# Altium project Complex_PCB.PrjPcb (part 1 of 3)
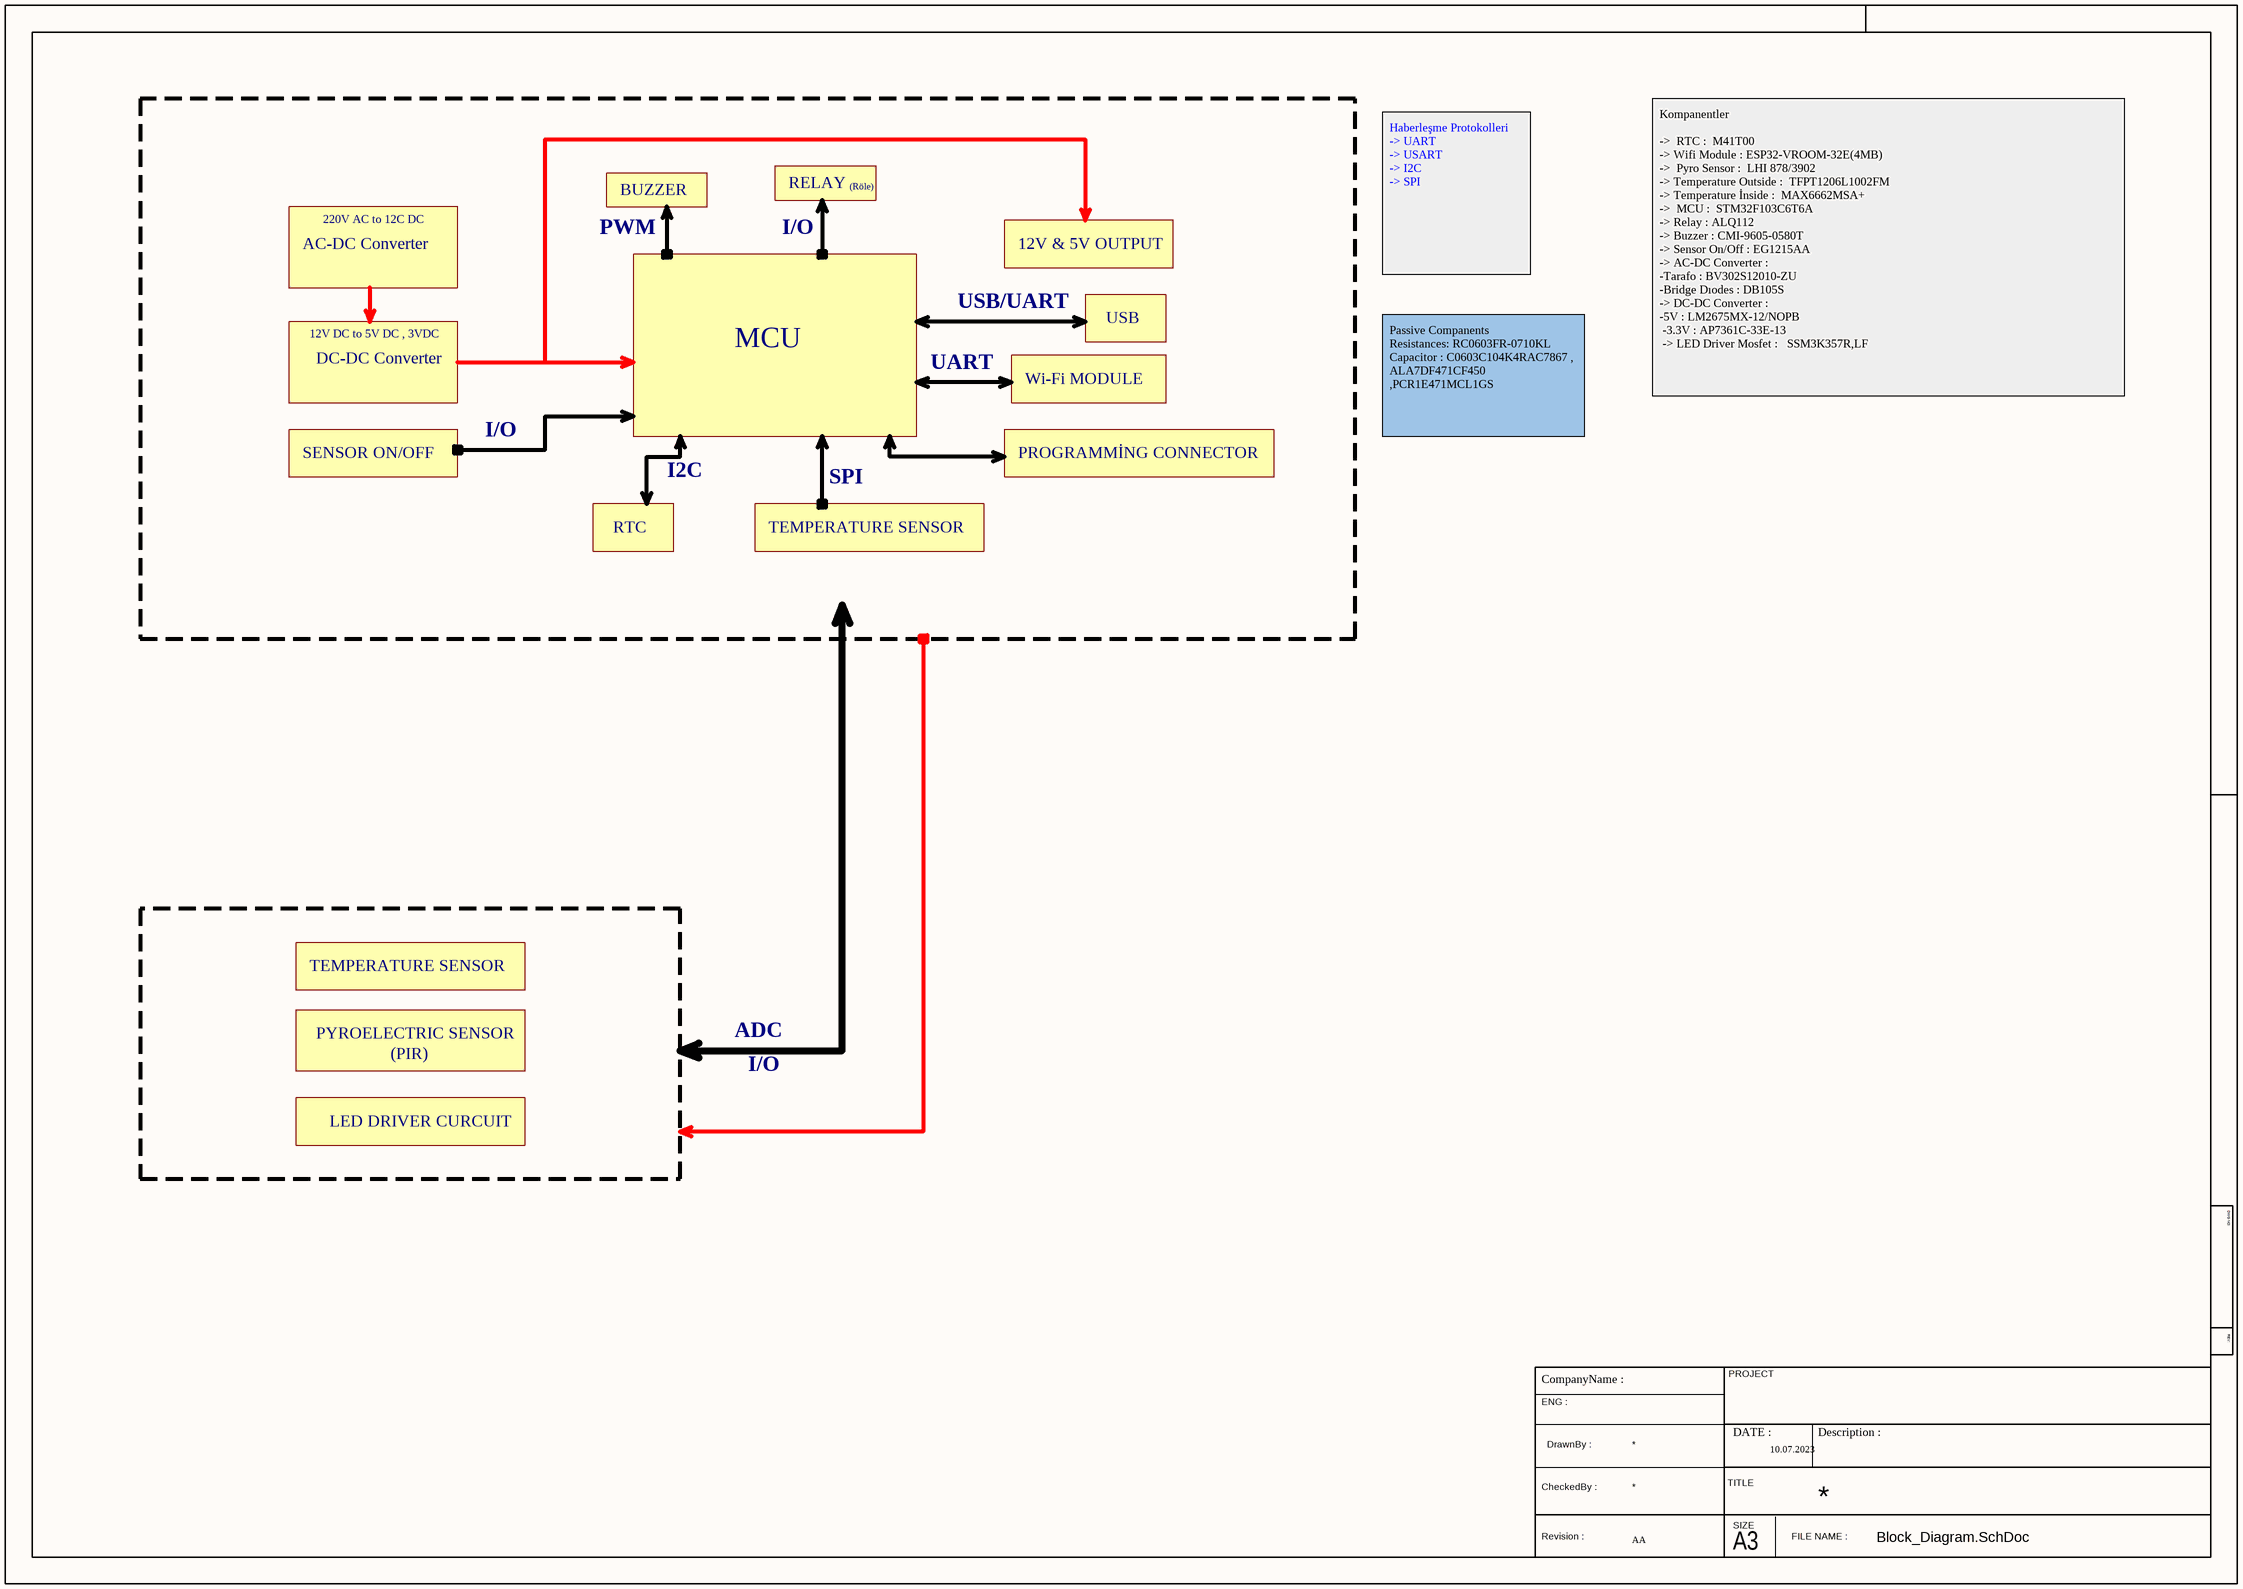
[diagram p0: Block_Diagram.SchDoc]
4 sheets, 127 parts. Net scope: flat (ports and power ports of the same name join across sheets).
Board file: ComplexCurcuit.PcbDoc
Sheets:
  Block_Diagram.SchDoc
  PowerManagment.SchDoc
  Microcontroller.SchDoc
  SensorBoard.SchDoc

## Sheet Block_Diagram.SchDoc
size 420 x 297 mm; Date: 10.07.2023; Revision: AA; SheetNumber: 1; SheetTotal: 4

### Notes on the sheet
- RELAY
- (Röle)
- AC-DC Converter
- 220V AC to 12C DC
- PWM
- BUZZER
- I/O
- 12V & 5V OUTPUT
- USB/UART
- USB
- Haberleşme Protokolleri                                                       -> UART                                                                               -> USART                                                                              -> I2C                                                                                   -> SPI
- 12V DC to 5V DC , 3VDC
- DC-DC Converter
- MCU
- UART
- Wi-Fi MODULE
- Kompanentler
  ->  RTC :  M41T00
  -> Wifi Module : ESP32-VROOM-32E(4MB)
  ->  Pyro Sensor :  LHI 878/3902
  -> Temperature Outside :  TFPT1206L1002FM
  -> Temperature İnside :  MAX6662MSA+
  ->  MCU :  STM32F103C6T6A
  -> Relay : ALQ112
  -> Buzzer : CMI-9605-0580T
  -> Sensor On/Off : EG1215AA
  -> AC-DC Converter :
  -Tarafo : BV302S12010-ZU
  -Bridge Dıodes : DB105S
  -> DC-DC Converter :
  -5V : LM2675MX-12/NOPB
  -3.3V : AP7361C-33E-13
  -> LED Driver Mosfet :   SSM3K357R,LF
- SENSOR ON/OFF
- PROGRAMMİNG CONNECTOR
- Passive Companents
  Resistances: RC0603FR-0710KL
  Capacitor : C0603C104K4RAC7867 ,
  ALA7DF471CF450 ,PCR1E471MCL1GS
- RTC
- I2C
- TEMPERATURE SENSOR
- SPI
- PYROELECTRIC SENSOR
- (PIR)
- ADC
- LED DRIVER CURCUIT
- DWG NO:
- REV:
- ENG :
- CompanyName :
- PROJECT
- DrawnBy :
- DATE :
- Description :
- Revision :
- CheckedBy :
- TITLE
- SIZE
- FILE NAME :
- A3

## Sheet PowerManagment.SchDoc
size 420 x 297 mm; SheetNumber: 2; SheetTotal: 5
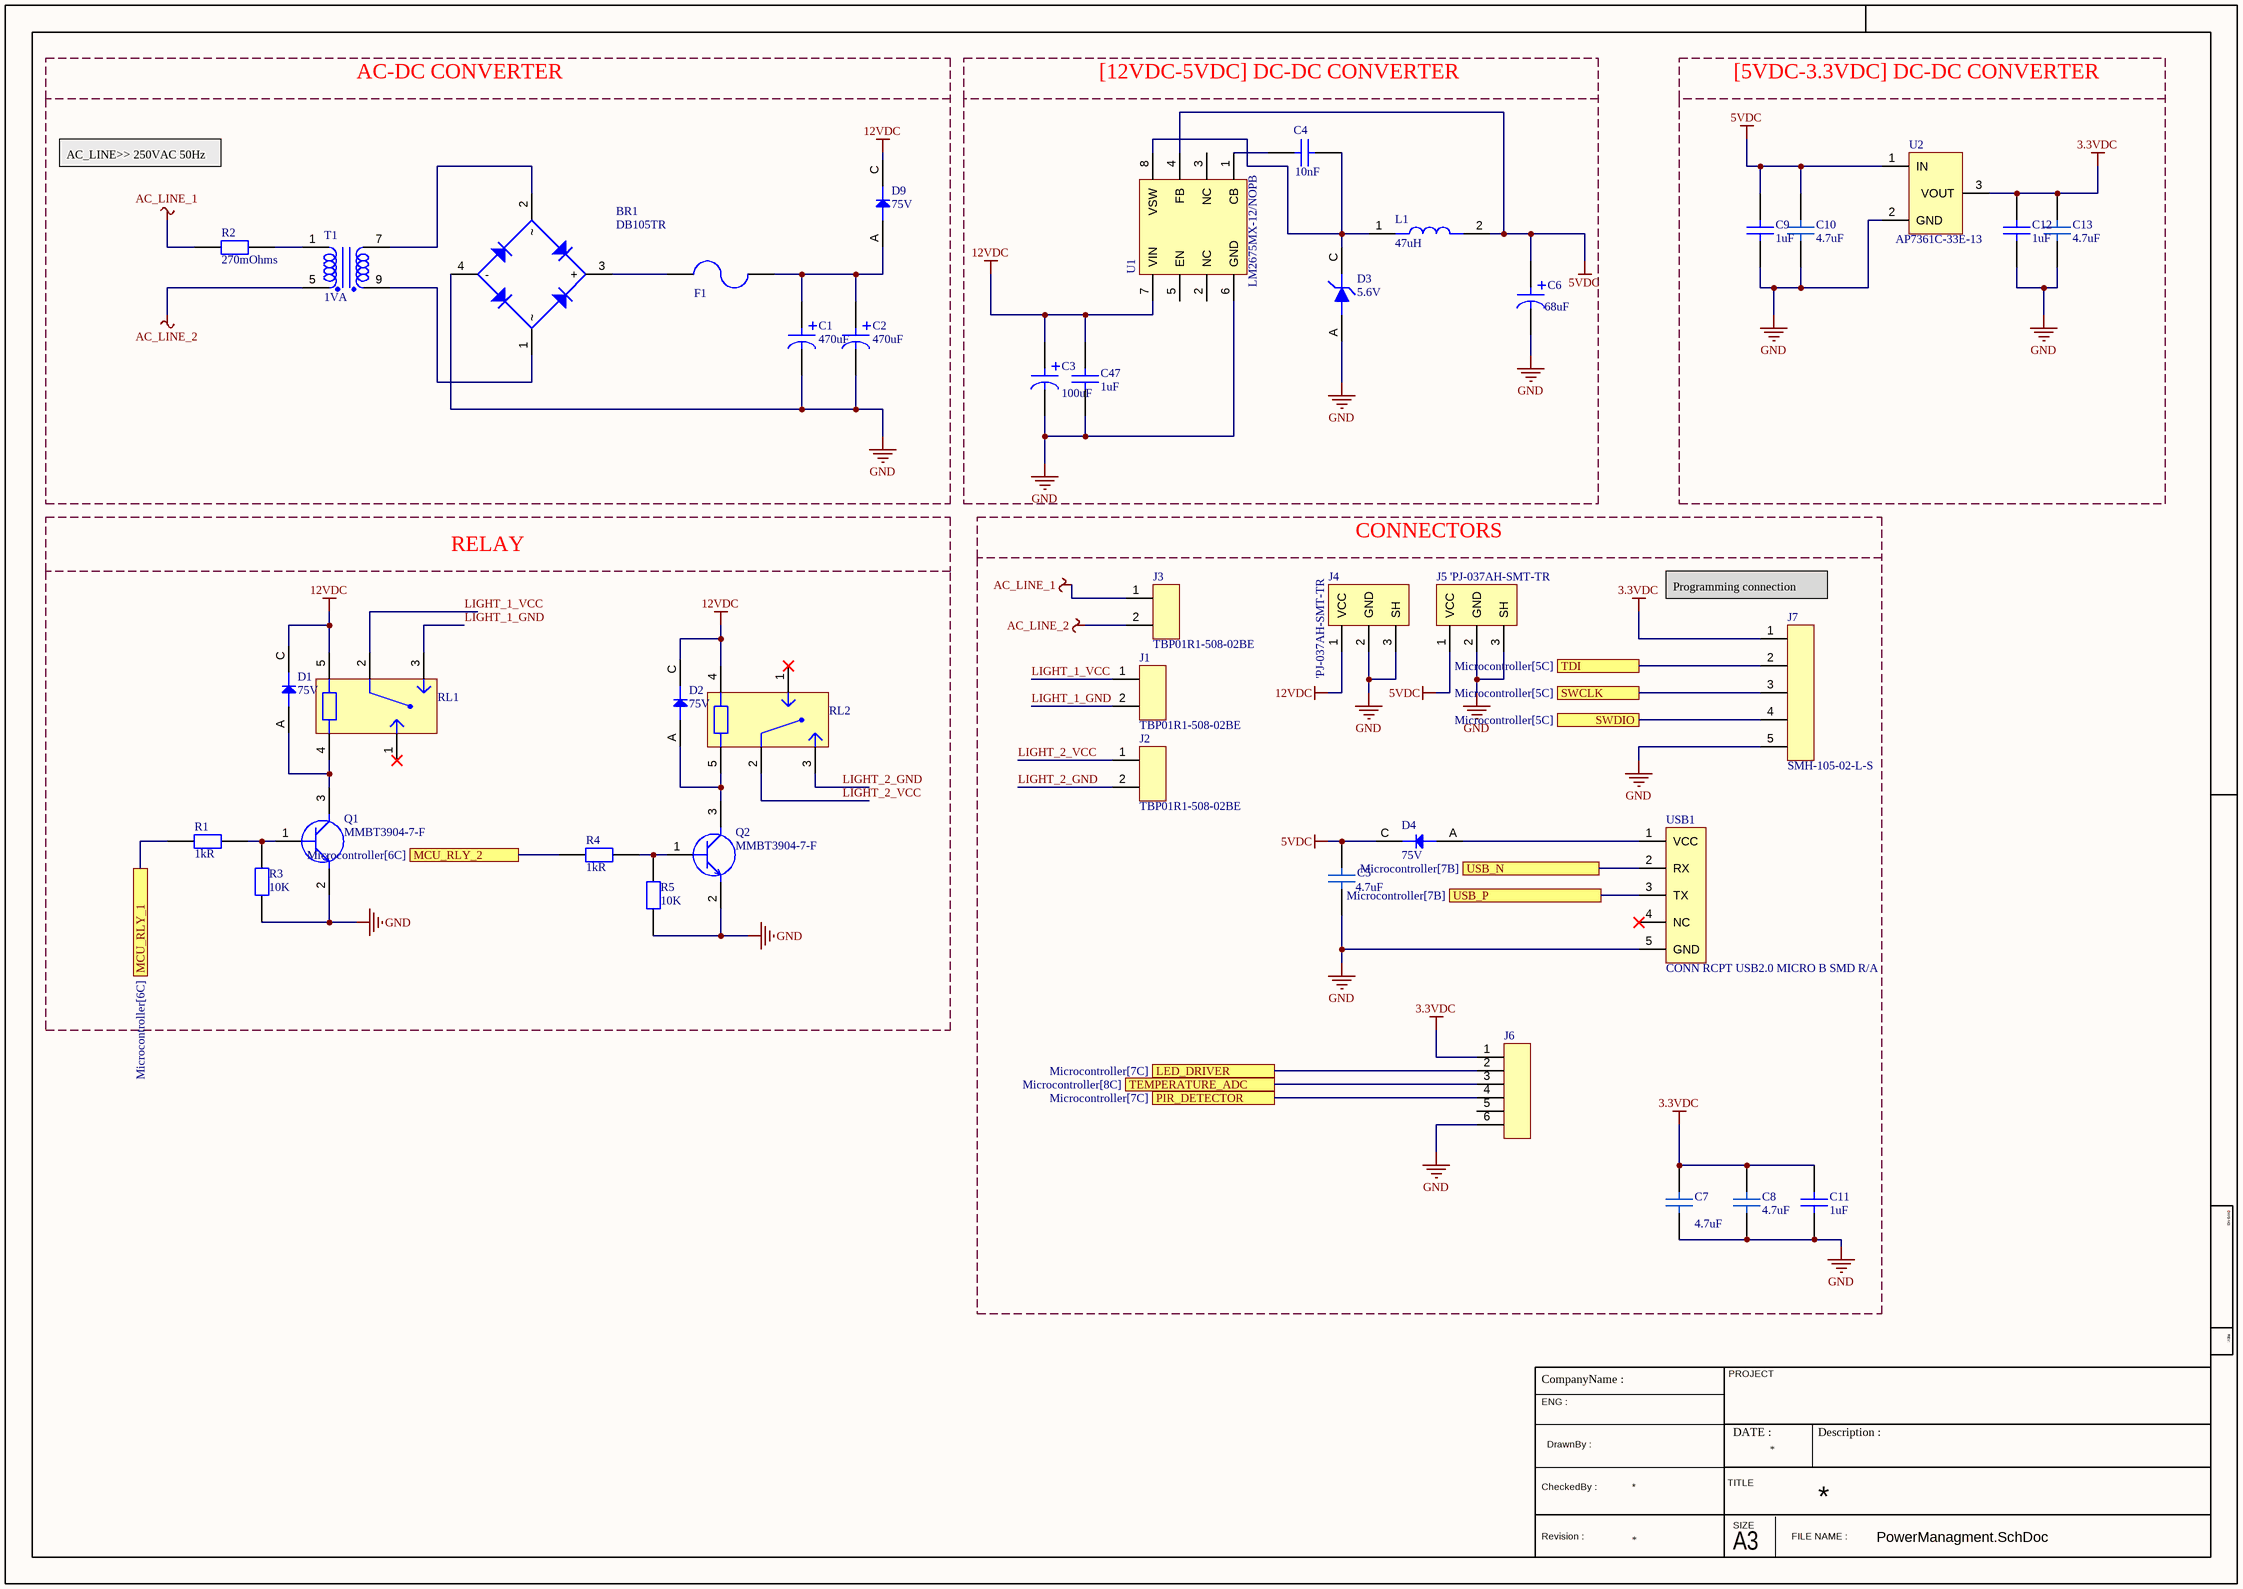
[diagram p1: PowerManagment.SchDoc]

### Parts
BR1  DB105TR  [DB105S]
C1  Capacitance: 470uF  [CAP _RADİAL_D10_P5]  (hidden comment: ESH477M050AH4AA CAP)
C2  Capacitance: 470uF  [CAP _RADİAL_D10_P5]  (hidden comment: ESH477M050AH4AA CAP)
C3  Capacity: 100uF  [CAP AEC Nichicon]  (hidden comment: UWT1H101MNL1GS)
C4  Capacity: 10nF  [CAP 0603]  (hidden comment: 0603B103K160CT)
C5  value 4.7uF  [CAP 0805]  (hidden comment: CAP CER 4.7UF 25V X5R 0805)
C6  Capacitance: 68uF  [CAP_EEVSERİES]  (hidden comment: EEV686M035A9HAA)
C7  value 4.7uF  [CAP 0805]  (hidden comment: CAP CER 4.7UF 25V X5R 0805)
C8  value 4.7uF  [CAP 0805]  (hidden comment: CAP CER 4.7UF 25V X5R 0805)
C9  Capacitance: 1uF  [CAP 0805]  (hidden comment: CAP CER 1UF 50V X7R 0805)
C10  value 4.7uF  [CAP 0805]  (hidden comment: CAP CER 4.7UF 25V X5R 0805)
C11  Capacitance: 1uF  [CAP 0805]  (hidden comment: CAP CER 1UF 50V X7R 0805)
C12  Capacitance: 1uF  [CAP 0805]  (hidden comment: CAP CER 1UF 50V X7R 0805)
C13  value 4.7uF  [CAP 0805]  (hidden comment: CAP CER 4.7UF 25V X5R 0805)
C47  Capacitance: 1uF  [CAP 0805]  (hidden comment: CAP CER 1UF 50V X7R 0805)
D1  Operating Voltage: 75V  [SOD323F]  (hidden comment: DIODE GEN PURP 75V 150MA SOD323F)
D2  Operating Voltage: 75V  [SOD323F]  (hidden comment: DIODE GEN PURP 75V 150MA SOD323F)
D3  Working Voltage: 5.6V  [SMB]  (hidden comment: 1SMB5919BT3G)
D4  Operating Voltage: 75V  [SOD323F]  (hidden comment: DIODE GEN PURP 75V 150MA SOD323F)
D9  Operating Voltage: 75V  [SOD323F]  (hidden comment: DIODE GEN PURP 75V 150MA SOD323F)
F1  3413.0216.22  [3413.0216.22 FUSE]  (value not drawn)
J1  TBP01R1-508-02BE  [TBP01R1-508]
J2  TBP01R1-508-02BE  [TBP01R1-508]
J3  TBP01R1-508-02BE  [TBP01R1-508]
J4  'PJ-037AH-SMT-TR  [JACK]
J5  'PJ-037AH-SMT-TR  [JACK]
J6  64800611622 Datasheet WR-WTB Male Vertical Shrouded Header  [64800611622 Connector-1x6 Male Header]  (value not drawn)
J7  SMH-105-02-L-S  [SMH-105-02-L-S]
L1  value 47uH  [IND_1212]  (hidden comment: 78438335470)
Q1  MMBT3904-7-F  [SOT23F]
Q2  MMBT3904-7-F  [SOT23F]
R1  value 1kR  [RES 0603]  (hidden comment: RC0603FR-071KL)
R2  Resistance: 270mOhms  [RES_AXİAL_W]  (hidden comment: 5WD27)
R3  Resistance: 10K  [RES 0603]  (hidden comment: RES 10K OHM  06103)
R4  value 1kR  [RES 0603]  (hidden comment: RC0603FR-071KL)
R5  Resistance: 10K  [RES 0603]  (hidden comment: RES 10K OHM  06103)
RL1  ALQ112  [ALQ112]  (value not drawn)
RL2  ALQ112  [ALQ112]  (value not drawn)
T1  Rated Power: 1VA  [BV302S]  (hidden comment: BV302S12010)
U1  LM2675MX-12/NOPB  [SOIC8]
U2  AP7361C-33E-13  [SOT223]
USB1  CONN RCPT USB2.0 MICRO B SMD R/A  [Micro B USB Connector]

### Blocks framed on the sheet
AC-DC CONVERTER: BR1 C1 C2 D9 F1 R2 T1
[12VDC-5VDC] DC-DC CONVERTER: C3 C4 C6 C47 D3 L1 U1
[5VDC-3.3VDC] DC-DC CONVERTER: C9 C10 C12 C13 U2
RELAY: D1 D2 Q1 Q2 R1 R3-R5 RL1 RL2
CONNECTORS: C5 C7 C8 C11 D4 J1-J7 USB1

### Ports
LED_DRIVER (see Microcontroller[7C]), MCU_RLY_1 (see Microcontroller[6C]), MCU_RLY_2 (see Microcontroller[6C]), PIR_DETECTOR (see Microcontroller[7C]), SWCLK (see Microcontroller[5C]), SWDIO (see Microcontroller[5C]), TDI (see Microcontroller[5C]), TEMPERATURE_ADC (see Microcontroller[8C]), USB_N (see Microcontroller[7B]), USB_P (see Microcontroller[7B])

### Nets
3.3VDC: C7.2 C8.2 C11.2 C12.1 C13.1 J6.1 J7.1 U2.3(VOUT)
5VDC: C5.2 C6.1 C9.1 C10.1 D4.C(Cathode) J5.1(VCC) L1.2 U1.4(FB) U2.1(IN)
12VDC: C3.1 C47.1 D1.C(Cathode) D2.C(Cathode) D9.C(Cathode) J4.1(VCC) RL1.5 RL2.4 U1.7(VIN)
AC_LINE_1: J3.1 R2.1
AC_LINE_2: J3.2 T1.5
GND: BR1.4(-) C1.2 C2.2 C3.2 C5.1 C6.2 C7.1 C8.1 C9.2 C10.2 C11.1 C12.2 C13.2 C47.2 D3.A(Anode) J4.2(GND) J4.3(SH) J5.2(GND) J5.3(SH) J6.6 J7.5 Q1.2(EMİTTER) Q2.2(EMİTTER) R3.1 R5.1 U1.6(GND) U2.2(GND) USB1.5(GND)
LIGHT_1_GND: J1.2 RL1.3
LIGHT_1_VCC: J1.1 RL1.2
LIGHT_2_GND: J2.2 RL2.3
LIGHT_2_VCC: J2.1 RL2.2
USB_N: USB1.2(RX) ; port USB_N
USB_P: USB1.3(TX) ; port USB_P
NetBR1_1: BR1.1 T1.9
NetBR1_2: BR1.2 T1.7
NetBR1_3: BR1.3(+) F1.1
NetC1_1: C1.1 C2.1 D9.A(Anode) F1.2
NetC4_1: C4.1 U1.1(CB)
NetC4_2: C4.2 D3.C(Cathode) L1.1 U1.8(VSW)
NetD1_A: D1.A(Anode) Q1.3(CONNECTOR) RL1.4
NetD2_A: D2.A(Anode) Q2.3(CONNECTOR) RL2.5
NetD4_A: D4.A(Anode) USB1.1(VCC)
NetJ6_2: J6.2 ; port LED_DRIVER
NetJ6_3: J6.3 ; port TEMPERATURE_ADC
NetJ6_4: J6.4 ; port PIR_DETECTOR
NetJ7_2: J7.2 ; port TDI
NetJ7_3: J7.3 ; port SWCLK
NetJ7_4: J7.4 ; port SWDIO
NetQ1_1: Q1.1(BASE) R1.2 R3.2
NetQ2_1: Q2.1(BASE) R4.2 R5.2
NetR1_1: R1.1 ; port MCU_RLY_1
NetR2_2: R2.2 T1.1
NetR4_1: R4.1 ; port MCU_RLY_2

Not connected (* = marked no-connect by the designer): J6 5; RL1 1*; RL2 1*; U1 2(NC) 3(NC) 5(EN); USB1 4(NC)*

### Notes on the sheet
- AC_LINE>> 250VAC 50Hz
- (near J7) Programming connection
- DWG NO:
- REV:
- ENG :
- CompanyName :
- PROJECT
- DrawnBy :
- DATE :
- Description :
- Revision :
- CheckedBy :
- TITLE
- SIZE
- FILE NAME :
- A3

### Library data of the parts
BR1 = DB105TR: Bridge Rectifier, Full Wave, 600 Volt,; Manufacturer: SMC Diode Solutions; Designed By: Görkem Bulut; Max Curent: 1A; Operating Voltage: 600V; Supplier: Digi-Key; Supplier Part Number: 1655-DB105STR-ND; Manufacturer Part Number: DB105S; RoHS: Yes; Category: Rectifier Diodes; Stock: 1865; Min Operating Temperature: -55°C; Max Operating Temperature: 150°C; RoHS Compliant: Yes; ComponentLink1URL: http://www.mouser.com/ds/2/345/db101-107-32844.pdf?src-supplier=Mouser; ComponentLink1Description: http://www.mouser.com/ds/2/345/db101-107-32844.pdf?src-supplier=Mouser; Case Package: DB-S; Number of Pins: 4
C1 C2 = ESH477M050AH4AA CAP: Cap, 470UF, 50V, Alu Elec, Radial; Manufacturer: KEMET; Designed By: Görkem Bulut; Supplier: Digi-Key; Supplier Part Number: 399-15683-ND; Manufacturer Part Number: ESH477M050AH4AA; RoHS: Yes; Stock: 6719; Pricing: 1=0,68, 10=0,482, 50=0,3646, 100=0,3175, 500=0,23518, 1000=0,19991, 2500=0,18815, 5000=0,17639 (USD); ComponentLink1URL: https://api.kemet.com/component-edge/download/datasheet/ESH477M050AH4AA.pdf?src-supplier=Digi-Key; ComponentLink1Description: https://api.kemet.com/component-edge/download/datasheet/ESH477M050AH4AA.pdf?src-supplier=Digi-Key; ComponentLink2URL: https://datasheet.octopart.com/ESH477M050AH4AA-KEMET-datasheet-130075338.pdf?src-supplier=Newark; ComponentLink2Description: https://datasheet.octopart.com/ESH477M050AH4AA-KEMET-datasheet-130075338.pdf?src-supplier=Newark
C3 = CAP CER 100uF AEC: Aluminum Electrolytic Capacitor, 100uF 50 V dc, WT Series 1000h 8 (Dia.) x 10mm; Manufacturer: Nichicon; Designed By: Görkem BULUT; Supplier: Digi-Key; Supplier Part Number: 493-2226-1-ND; Manufacturer Part Number: UWT1H101MNL1GS; RoHS: Yes; Category: Aluminum Electrolytic Capacitors; Stock: 94104; Pricing: 1=0,45, 10=0,317, 50=0,2398, 100=0,2089 (USD); ComponentLink1URL: https://datasheet.ciiva.com/97/e-wt-97104.pdf?src-supplier=Digi-Key; ComponentLink1Description: https://datasheet.ciiva.com/97/e-wt-97104.pdf?src-supplier=Digi-Key; ComponentLink2URL: https://datasheet.ciiva.com/97/e-wt-97105.pdf?src-supplier=Digi-Key; ComponentLink2Description: https://datasheet.ciiva.com/97/e-wt-97105.pdf?src-supplier=Digi-Key; ComponentLink3URL: https://datasheet.ciiva.com/97/e-wt-97106.pdf?src-supplier=Digi-Key; ComponentLink3Description: https://datasheet.ciiva.com/97/e-wt-97106.pdf?src-supplier=Digi-Key; ComponentLink4URL: https://datasheet.ciiva.com/11776/0900766b80fa3a91-11776930.pdf?src-supplier=Rs; ComponentLink4Description: https://datasheet.ciiva.com/11776/0900766b80fa3a91-11776930.pdf?src-supplier=Rs; ComponentLink5URL: https://datasheet.ciiva.com/16502/e-wt-16502940.pdf?src-supplier=Future+Electronics; ComponentLink5Description: https://datasheet.ciiva.com/16502/e-wt-16502940.pdf?src-supplier=Future+Electronics; ComponentLink6URL: https://datasheet.ciiva.com/5362/e-wt-30307-5362773.pdf?src-supplier=Mouser; ComponentLink6Description: https://datasheet.ciiva.com/5362/e-wt-30307-5362773.pdf?src-supplier=Mouser; ComponentLink7URL: https://datasheet.ciiva.com/11686/e-wt-11686889.pdf?src-supplier=Avnet; ComponentLink7Description: https://datasheet.ciiva.com/11686/e-wt-11686889.pdf?src-supplier=Avnet; ComponentLink8URL: https://datasheet.ciiva.com/28458/1910938-28458459.pdf?src-supplier=Element14; ComponentLink8Description: https://datasheet.ciiva.com/28458/1910938-28458459.pdf?src-supplier=Element14; ComponentLink9URL: https://datasheet.ciiva.com/7781/e-wt-7781807.pdf?src-supplier=Element14; ComponentLink9Description: https://datasheet.ciiva.com/7781/e-wt-7781807.pdf?src-supplier=Element14; Package/Case: Radial, Can - SMD
C4 = CAP CER 10nF: Multilayer Ceramic Capacitor, 0.01 F, 10%, X7R, 16 V, 0603 [1608 Metric] RoHS Compliant: Yes; Manufacturer: Walsin Technologies; Supplier: Digi-Key; Supplier Part Number: 1292-1384-1-ND; Manufacturer Part Number: 0603B103K160CT; RoHS: Yes; Category: Ceramic Capacitors; Stock: 44618; Pricing: 1=0,1, 10=0,033, 50=0,0182, 100=0,0148, 500=0,0106, 1000=0,00833 (USD); ComponentLink1URL: http://www.farnell.com/datasheets/1958513.pdf?src-supplier=Farnell; ComponentLink1Description: http://www.farnell.com/datasheets/1958513.pdf?src-supplier=Farnell; ComponentLink2URL: http://www.passivecomponent.com/wp-content/uploads/2018/10/MLCC.pdf?src-supplier=Digi-Key; ComponentLink2Description: http://www.passivecomponent.com/wp-content/uploads/2018/10/MLCC.pdf?src-supplier=Digi-Key; ComponentLink3URL: https://datasheet.octopart.com/0603B103K160CT-Walsin-Technologies-datasheet-85392065.pdf?src-supplier=Element14; ComponentLink3Description: https://datasheet.octopart.com/0603B103K160CT-Walsin-Technologies-datasheet-85392065.pdf?src-supplier=Element14; ComponentLink4URL: https://datasheet.octopart.com/0603B103K160CT-Walsin-Technologies-datasheet-136037192.pdf?src-supplier=Future+Electronics; ComponentLink4Description: https://datasheet.octopart.com/0603B103K160CT-Walsin-Technologies-datasheet-136037192.pdf?src-supplier=Future+Electronics; ComponentLink5URL: https://datasheet.octopart.com/0603B103K160CT-Walsin-Technologies-datasheet-62066062.pdf?src-supplier=TME; ComponentLink5Description: https://datasheet.octopart.com/0603B103K160CT-Walsin-Technologies-datasheet-62066062.pdf?src-supplier=TME; Case/Package: 0603
C5 C7 C8 C10 C13 = CAP CER 4.7uF: Manufacturer: Samsung; Manufacturer Part Number: CL21A475KAQNNNE; Tolerance: 10%; Supplier: Digi-Key; Supplier Part Number: 1276-1244-1-ND; RoHS: Yes; Category: Ceramic Capacitors; Stock: 3937628; Pricing: 1=0,1, 10=0,073, 50=0,0414, 100=0,0344, 500=0,02408, 1000=0,01994 (USD); Mounting Technology: Surface Mount; Case/Package: 0805; Case Code (Metric): 2012; Case Code (Imperial): 0805; Min Operating Temperature: -55°C; Max Operating Temperature: 85°C; Packaging: Tape and Reel; Voltage Rating: 25V; Dielectric: X5R; Voltage Rating (DC): 25V; Series: CL; Construction: Flat; Length: 2mm; Height: 1.25mm; Depth: 1.25mm; Radiation Hardening: No; Lead Free: Lead Free; RoHS Compliant: Yes; ComponentLink1URL: https://datasheet.ciiva.com/25798/cl21a475kaqnnne-25798882.pdf?src-supplier=Digi-Key; ComponentLink1Description: https://datasheet.ciiva.com/25798/cl21a475kaqnnne-25798882.pdf?src-supplier=Digi-Key
C6 = CAP 68uF AEC: Cap Aluminum Lytic 68uF 35V 20%( 6.3 X 7.7mm) SMD 0.34 Ohm 280mA 2000h 105C T/R; Manufacturer: KEMET; Designed By: Görkem Bulut; Supplier: Digi-Key; Supplier Part Number: 399-6722-1-ND; Manufacturer Part Number: EEV686M035A9HAA; RoHS: Yes; Category: Aluminum Electrolytic Capacitors; Stock: 22871; Pricing: 1=0,62, 10=0,439, 50=0,332, 100=0,2892, 500=0,21422 (USD); ComponentLink1URL: https://datasheet.ciiva.com/5365/kem-a4002-eev-535332-5365784.pdf?src-supplier=Mouser; ComponentLink1Description: https://datasheet.ciiva.com/5365/kem-a4002-eev-535332-5365784.pdf?src-supplier=Mouser; Case Package: Radial,Can-SMD
C9 C11 C12 C47 = CAP CER 1uF: Manufacturer: Samsung; Manufacturer Part Number: CL21B105KBFNNNE; Designed By: Görkem Bulut; Supplier: Digi-Key; Supplier Part Number: 1276-1029-1-ND; RoHS: Yes; Category: Ceramic Capacitors; Stock: 142606; Pricing: 1=0,11, 10=0,079, 50=0,045, 100=0,0373, 500=0,02616, 1000=0,02165 (USD); ComponentLink1URL: https://datasheet.ciiva.com/16449/cl21b105kbfnnne-16449003.pdf?src-supplier=Future+Electronics; ComponentLink1Description: https://datasheet.ciiva.com/16449/cl21b105kbfnnne-16449003.pdf?src-supplier=Future+Electronics; ComponentLink2URL: https://datasheet.ciiva.com/25800/cl21b105kbfnnne-25800291.pdf?src-supplier=Digi-Key; ComponentLink2Description: https://datasheet.ciiva.com/25800/cl21b105kbfnnne-25800291.pdf?src-supplier=Digi-Key; Case Package: 0805
D1 D2 D4 D9 = 1N4148WS: VR=75V IF=150mA Trr=4ns P=200mW; Manufacturer: ON Semiconductor / Fairchild; Designed By: Görkem Bulut; Supplier: Digi-Key; Supplier Part Number: 1N4148WSFSCT-ND; Manufacturer Part Number: 1N4148WS; RoHS: Yes; Category: Rectifier Diodes; Stock: 1572050; Pricing: 1=0,18, 10=0,169, 100=0,0918, 500=0,0565, 1000=0,03852 (USD); ComponentLink1URL: https://datasheet.ciiva.com/15208/getdatasheetpartid-127819-15208358.pdf?src-supplier=Verical; ComponentLink1Description: https://datasheet.ciiva.com/15208/getdatasheetpartid-127819-15208358.pdf?src-supplier=Verical; Case Package: SOD323F; Operatşng Current: 150mA
D3 = 1SMB5919BT3G: Vz=5.6V 5.32V~5.88V Izt=66.9mA; Manufacturer: ON Semiconductor; Designed By: Görkem Bulut; Supplier: Mouser; Supplier Part Number: 863-1SMB5919BT3G; Manufacturer Part Number: 1SMB5919BT3G; RoHS: Yes; Category: Zener Diodes; Stock: 197; Pricing: 1=0,51, 10=0,37, 50=0,37, 100=0,231, 1000=0,128, 10000=0,094 (USD); ComponentLink1URL: https://datasheet.ciiva.com/27747/1308331-27747654.pdf?src-supplier=Jameco; ComponentLink1Description: https://datasheet.ciiva.com/27747/1308331-27747654.pdf?src-supplier=Jameco; ComponentLink2URL: https://datasheet.ciiva.com/895/1smb5913bt3-d-895203.pdf?src-supplier=Digi-Key; ComponentLink2Description: https://datasheet.ciiva.com/895/1smb5913bt3-d-895203.pdf?src-supplier=Digi-Key; ComponentLink3URL: https://datasheet.ciiva.com/895/1smb5913bt3-d-895204.pdf?src-supplier=Digi-Key; ComponentLink3Description: https://datasheet.ciiva.com/895/1smb5913bt3-d-895204.pdf?src-supplier=Digi-Key; ComponentLink4URL: https://datasheet.ciiva.com/895/1smb5913bt3-d-895205.pdf?src-supplier=Digi-Key; ComponentLink4Description: https://datasheet.ciiva.com/895/1smb5913bt3-d-895205.pdf?src-supplier=Digi-Key; ComponentLink5URL: https://datasheet.ciiva.com/15198/getdatasheetpartid-311040-15198695.pdf?src-supplier=Verical; ComponentLink5Description: https://datasheet.ciiva.com/15198/getdatasheetpartid-311040-15198695.pdf?src-supplier=Verical; ComponentLink6URL: https://datasheet.ciiva.com/1182/1smb5913bt3-d-1182657.pdf?src-supplier=Element14; ComponentLink6Description: https://datasheet.ciiva.com/1182/1smb5913bt3-d-1182657.pdf?src-supplier=Element14; ComponentLink7URL: https://datasheet.ciiva.com/1182/1smb5913bt3-d-1182658.pdf?src-supplier=Element14; ComponentLink7Description: https://datasheet.ciiva.com/1182/1smb5913bt3-d-1182658.pdf?src-supplier=Element14; ComponentLink8URL: https://datasheet.ciiva.com/16311/1smb5913bt3-d-16311847.pdf?src-supplier=Future+Electronics; ComponentLink8Description: https://datasheet.ciiva.com/16311/1smb5913bt3-d-16311847.pdf?src-supplier=Future+Electronics; Case Package: SMB
F1 = FUSE 3413.0216.22: Fuse Chip Fast Acting 1A 32V SMD Solder Pad 1206 Glass T/R VDE/cULus; Manufacturer: Schurter; Designed By: Görkem Bulut; Supplier: Digi-Key; Supplier Part Number: 486-1144-1-ND; Manufacturer Part Number: 3413.0216.22; RoHS: Yes; Category: Fuses; Stock: 9197; Pricing: 1=0,67, 50=0,524, 100=0,397, 500=0,3132 (USD); ComponentLink1URL: https://datasheet.ciiva.com/301/typ-usi-1206-301440.pdf?src-supplier=Digi-Key; ComponentLink1Description: https://datasheet.ciiva.com/301/typ-usi-1206-301440.pdf?src-supplier=Digi-Key; ComponentLink2URL: https://datasheet.ciiva.com/14102/qousi1206-data-e-14102903.pdf?src-supplier=Distrelec; ComponentLink2Description: https://datasheet.ciiva.com/14102/qousi1206-data-e-14102903.pdf?src-supplier=Distrelec; ComponentLink3URL: https://datasheet.ciiva.com/16316/typ-usi-1206-16316588.pdf?src-supplier=Future+Electronics; ComponentLink3Description: https://datasheet.ciiva.com/16316/typ-usi-1206-16316588.pdf?src-supplier=Future+Electronics; ComponentLink4URL: https://datasheet.ciiva.com/301/typ-usi-1206-301439.pdf?src-supplier=Digi-Key; ComponentLink4Description: https://datasheet.ciiva.com/301/typ-usi-1206-301439.pdf?src-supplier=Digi-Key; ComponentLink5URL: https://datasheet.ciiva.com/301/typ-usi-1206-301441.pdf?src-supplier=Digi-Key; ComponentLink5Description: https://datasheet.ciiva.com/301/typ-usi-1206-301441.pdf?src-supplier=Digi-Key; ComponentLink6URL: https://datasheet.ciiva.com/8264/typ-usi-1206-8264583.pdf?src-supplier=Avnet; ComponentLink6Description: https://datasheet.ciiva.com/8264/typ-usi-1206-8264583.pdf?src-supplier=Avnet; ComponentLink7URL: https://datasheet.ciiva.com/14541/70160006-14541114.pdf?src-supplier=Allied+Electronics; ComponentLink7Description: https://datasheet.ciiva.com/14541/70160006-14541114.pdf?src-supplier=Allied+Electronics
J1-J3 = TBP01R1-508-02BE: 2~24 Poles, Pluggable, Receptacle, Horizontal, 5.08 Pitch, Terminal Block Connector; Manufacturer: CUI Devices; Designed by: GÖRKEM BULUT; Supplier: Digi-Key; Supplier Part Number: 102-6406-ND; Manufacturer Part Number: TBP01R1-508-02BE; RoHS: Yes; Category: Terminal Blocks; Stock: 123466; Pricing: 1=0,56, 10=0,296, 25=0,2096, 50=0,1784, 100=0,1722, 250=0,1456, 500=0,13464, 1000=0,11898, 5000=0,0908 (USD); ComponentLink1URL: https://www.cuidevices.com/product/resource/digikeypdf/tbp01r1-508.pdf?src-supplier=Digi-Key; ComponentLink1Description: https://www.cuidevices.com/product/resource/digikeypdf/tbp01r1-508.pdf?src-supplier=Digi-Key; ComponentLink2URL: https://datasheet.octopart.com/TBP01R1-508-02BE-CUI-Devices-datasheet-147843976.pdf?src-supplier=Future+Electronics; ComponentLink2Description: https://datasheet.octopart.com/TBP01R1-508-02BE-CUI-Devices-datasheet-147843976.pdf?src-supplier=Future+Electronics; ComponentLink3URL: https://datasheet.octopart.com/TBP01R1-508-02BE-CUI-Devices-datasheet-154730754.pdf?src-supplier=Electro+Sonic; ComponentLink3Description: https://datasheet.octopart.com/TBP01R1-508-02BE-CUI-Devices-datasheet-154730754.pdf?src-supplier=Electro+Sonic
J4 J5 = PJ-037AH-SMT-TR: 2.0 x 6.3 mm, 5.0 A, Horizontal, Surface Mount (SMT), Dc Power Jack Connector; Manufacturer: CUI; Number of Conductors: 2; Gender: Male; Shielding: Unshielded; Current Rating: 5A; Voltage Rating: 24V; Insulation Resistance: 100MR; Designed By: Görkem Bulut; Supplier: Digi-Key; Supplier Part Number: CP-037AHPJCT-ND; Manufacturer Part Number: PJ-037AH-SMT-TR; RoHS: Yes; Category: Uncategorized; Mounting Technology: Surface Mount,Through Hole; Case/Package: SMD/SMT; Color: Black; Contact Material: Copper; Contact Plating: Nickel; Housing Color: Black; Housing Material: Thermoplastic; Min Operating Temperature: -25°C; Max Operating Temperature: 85°C; Orientation: Horizontal; Package Quantity: 200; Termination: Solder; Connector Type: Jack; Contact Gender: Male; Packaging: Tape and Reel; Flammability Rating: UL94 V-0; ComponentLink1URL: http://www.mouser.com/ds/2/670/pj-037ah-smt-516065.pdf?src-supplier=Mouser; ComponentLink1Description: http://www.mouser.com/ds/2/670/pj-037ah-smt-516065.pdf?src-supplier=Mouser; ComponentLink2URL: https://www.cui.com/product/resource/digikeypdf/pj-037ah-smt-tr.pdf?src-supplier=Digi-Key; ComponentLink2Description: https://www.cui.com/product/resource/digikeypdf/pj-037ah-smt-tr.pdf?src-supplier=Digi-Key; ComponentLink3URL: http://www.cui.com/product/resource/digikeypdf/pj-037ah-smt.pdf?src-supplier=Digi-Key; ComponentLink3Description: http://www.cui.com/product/resource/digikeypdf/pj-037ah-smt.pdf?src-supplier=Digi-Key
J6 = 1x6 Male Header-64800611622 Connector: WR-WTB Wire-to-Board Connectors 1.50 mm; Manufacturer: Wurth Electronics; Designed By: Görkem Bulut; Supplier: Digi-Key; Supplier Part Number: 732-64800611622-ND; Manufacturer Part Number: 64800611622; RoHS: No; Category: Uncategorized; Stock: 924; Pricing: 1=0,42, 50=0,406, 100=0,384, 250=0,361, 500=0,339 (USD)
J7 = SMH-105-02-L-S: .100 C.L. HORIZONTAL SMT SOCKET; Manufacturer: Samtec; Number of Contacts: 5; Gender: Receptacle; Pitch: 2.54mm; Supplier: Digi-Key; Supplier Part Number: SAM11813-ND; Manufacturer Part Number: SMH-105-02-L-S; RoHS: Yes; Category: Connectors; Stock: 101; Pricing: 1=2,18, 10=1,899, 100=1,6968, 500=1,414, 1000=1,212, 5000=1,07464 (USD); Contact Plating: Gold; Contact Material: Bronze; Contact Finish - Mating: GOLD; Insulation Color: Black; Insulation Material: Polymer; Contact Shape: Square; Min Operating Temperature: -55°C; Max Operating Temperature: 125°C; Packaging: Rail/Tube; Number of Rows: 1; Termination: Solder; Orientation: Horizontal; Connector Type: Receptacle; Fastening Type: Pull; Series: SMH; Contact Type: Forked; Number of Positions: 5; Radiation Hardening: No; RoHS Compliant: Yes; Reach SVHC Compliant: No; Flammability Rating: UL94 V-0; ComponentLink1URL: http://www.farnell.com/datasheets/1927708.pdf?_ga=2.237598468.569325269.1503285096-1413671594.1503025027&src-supplier=Farnell; ComponentLink1Description: http://www.farnell.com/datasheets/1927708.pdf?_ga=2.237598468.569325269.1503285096-1413671594.1503025027&src-supplier=Farnell; ComponentLink2URL: http://www.samtec.com/documents/webfiles/pdf/SMH.PDF?src-supplier=Newark; ComponentLink2Description: http://www.samtec.com/documents/webfiles/pdf/SMH.PDF?src-supplier=Newark; ComponentLink3URL: http://www.samtec.com/documents/webfiles/pdf/SMH.PDF?src-supplier=Avnet; ComponentLink3Description: http://www.samtec.com/documents/webfiles/pdf/SMH.PDF?src-supplier=Avnet; ComponentLink4URL: http://suddendocs.samtec.com/catalog_english/smh.pdf?src-supplier=Digi-Key; ComponentLink4Description: http://suddendocs.samtec.com/catalog_english/smh.pdf?src-supplier=Digi-Key
L1 = IND 47uH: Power Inductor, Aec-Q200, 47Uh, 0.39A Rohs Compliant: Yes |Wurth Elektronik 78438335470; Manufacturer: Wurth Electronics; Core Material: Ferrite; Current Rating: 390mA; Saturation Current: 1.18A; Shielding: Shielded; DC Resistance (DCR): 2.3R; Self Resonant Frequency: 8MHz; Test Frequency: 100kHz; Tolerance: 30%; Designed By: Görkem Bulut; Supplier: Digi-Key; Supplier Part Number: 732-6947-1-ND; Manufacturer Part Number: 78438335470; RoHS: Yes; Category: Fixed Inductors; Stock: 14920; Pricing: 1=2,11, 50=1,97, 250=1,803, 500=1,672 (USD); Mounting Technology: Surface Mount; Case/Package: 1212; Case Code (Metric): 3030; Case Code (Imperial): 1212; Min Operating Temperature: -40°C; Max Operating Temperature: 125°C; Packaging: Cut Tape; Series: WE-MAIA; Length: 0.118inch; Width: 0.118inch; Height - Seated (Max): 0.059inch; Ratings: AEC-Q200; RoHS Compliant: Yes; ComponentLink1URL: https://media.digikey.com/pdf/Data%20Sheets/Wurth%20Electronics%20PDFs/Q+_Products_Flyer.pdf?src-supplier=Digi-Key; ComponentLink1Description: https://media.digikey.com/pdf/Data%20Sheets/Wurth%20Electronics%20PDFs/Q+_Products_Flyer.pdf?src-supplier=Digi-Key
Q1 Q2 = MMBT3904-7-F: Transistor General Purpose BJT NPN 40 Volt 0.2A Automotive 3-Pin SOT-23; Manufacturer: Diodes Zetex; Designed by: Gökem Bulut; Max Power Dissipation: 300mW; Collector Emitter Voltage (VCEO): 40V; Max Collector Current: 200mA; Collector Base Voltage (VCBO): 60V; Power Dissipation: 350mW; Frequency: 300MHz; hFE Min: 100; Number of Elements: 1; Emitter Base Voltage (VEBO): 6V; Collector Emitter Saturation Voltage: 300mV; Supplier: Digi-Key; Supplier Part Number: MMBT3904-FDICT-ND; Manufacturer Part Number: MMBT3904-7-F; RoHS: Yes; Category: BJTs; Stock: 6151063; Pricing: 1=0,12, 10=0,111, 100=0,0607, 500=0,03732, 1000=0,02545 (USD); Mounting Technology: Surface Mount; Case/Package: SOT-23; Pins: 3; Weight: 0.000282oz; Min Operating Temperature: -55°C; Max Operating Temperature: 150°C; Polarity: NPN; Packaging: Tape and Reel; Package Quantity: 3000; Transition Frequency: 300MHz; Collector Emitter Breakdown Voltage: 40V; Max Breakdown Voltage: 40V; Continuous Collector Current: 200mA; Clock Frequency: 300MHz; Gain Bandwidth Product: 300MHz; Voltage Rating (DC): 40V; Series: Automotive, AEC-Q101; Collector-emitter Voltage-Max: 300mV; Length: 3.05mm; Width: 1.4mm; Height: 1mm; Radiation Hardening: No; Reach SVHC Compliant: No; Lead Free: Lead Free; RoHS Compliant: Yes; ComponentLink1URL: https://datasheet.ciiva.com/11201/ds30036-11201778.pdf?src-supplier=Avnet; ComponentLink1Description: https://datasheet.ciiva.com/11201/ds30036-11201778.pdf?src-supplier=Avnet; ComponentLink2URL: https://datasheet.ciiva.com/15138/getdatasheetpartid-53265-15138780.pdf?src-supplier=Verical; ComponentLink2Description: https://datasheet.ciiva.com/15138/getdatasheetpartid-53265-15138780.pdf?src-supplier=Verical; ComponentLink3URL: https://datasheet.ciiva.com/22711/1915516-22711750.pdf?src-supplier=Element14; ComponentLink3Description: https://datasheet.ciiva.com/22711/1915516-22711750.pdf?src-supplier=Element14; ComponentLink4URL: https://datasheet.ciiva.com/11198/ds30036-11198999.pdf?src-supplier=Avnet; ComponentLink4Description: https://datasheet.ciiva.com/11198/ds30036-11198999.pdf?src-supplier=Avnet; ComponentLink5URL: https://datasheet.ciiva.com/6361/ds30036-6361256.pdf?src-supplier=Digi-Key; ComponentLink5Description: https://datasheet.ciiva.com/6361/ds30036-6361256.pdf?src-supplier=Digi-Key; ComponentLink6URL: https://datasheet.ciiva.com/6361/ds30036-6361254.pdf?src-supplier=Digi-Key; ComponentLink6Description: https://datasheet.ciiva.com/6361/ds30036-6361254.pdf?src-supplier=Digi-Key
R1 R4 = RES 1K OHM: SMD Chip Resistor, 1 kOhm, ± 1%, 100 mW, 0603 [1608 Metric], Thick Film, General Purpose; Manufacturer: Yageo; Temperature Coefficient: 100ppm/°C; Power Rating: 100mW; Voltage Rating: 50V; Designed By: Görkem B.; Supplier: Digi-Key; Supplier Part Number: 311-1.00KHRCT-ND; Manufacturer Part Number: RC0603FR-071KL; RoHS: Yes; Category: Chip SMD Resistors; Stock: 20509679; Pricing: 1=0,1, 10=0,018, 50=0,0106, 100=0,0088, 500=0,00592, 1000=0,00505 (USD); Case/Package: 0603; Contact Plating: Tin,Matte; Case Code (Imperial): 0603; Case Code (Metric): 1608; Min Operating Temperature: -55°C; Max Operating Temperature: 155°C; Tolerance: 1%; Packaging: Tape and Reel; Resistor Type: Thick Film; Termination: SMD/SMT; Features: Moisture Resistant; Series: RC; Max Power Dissipation: 100mW; Number of Terminations: 2; Technology: THICK FILM; Resistance Tolerance: 1%; Construction: Rectangular; Length: 1.6mm; Height: 0.45mm; Depth: 0.8mm; Reach SVHC Compliant: No; Lead Free: Lead Free; Military Standard: Not; RoHS Compliant: Yes; Case Package: 0603
R2 = 5WD27: 270 mOhms ±5% 5W Through Hole Resistor Axial Wirewound; Manufacturer: NTE Electronics, Inc; Designed By: Görkem Bulut; Tolerance: %5; Power (Watts): 5Watts; Supplier Part Number: 2368-5WD27-ND; Manufacturer Product Number: 5WD27; Detailed Description: 270 mOhms ±5% 5W Through Hole Resistor Axial Wirewound; Category: Through Hole Resistors,Axial; Number of Terminations: 2; Package / Case: Axial
R3 R5 = RES 10K OHM  06103: RES SMD 10K OHM 1% 1/10W 0603; Manufacturer: Yageo; Manufacturer Part Number: RC0603FR-0710KL; Designed by: Görkem Bulut; Number of Pads: 2; Supplier: Digi-Key; Supplier Part Number: 311-10.0KHRCT-ND; RoHS: Yes; Category: Chip SMD Resistors; Stock: 27252341; Pricing: 1=0,1, 10=0,018, 50=0,0106, 100=0,0088, 500=0,00592, 1000=0,00505 (USD); ComponentLink1URL: https://datasheet.ciiva.com/7660/38590-7660789.pdf?src-supplier=Element14; ComponentLink1Description: https://datasheet.ciiva.com/7660/38590-7660789.pdf?src-supplier=Element14; ComponentLink2URL: https://datasheet.ciiva.com/7746/1738695-7746239.pdf?src-supplier=Element14; ComponentLink2Description: https://datasheet.ciiva.com/7746/1738695-7746239.pdf?src-supplier=Element14; ComponentLink3URL: https://datasheet.ciiva.com/15189/getdatasheetpartid-409289-15189591.pdf?src-supplier=Verical; ComponentLink3Description: https://datasheet.ciiva.com/15189/getdatasheetpartid-409289-15189591.pdf?src-supplier=Verical; ComponentLink4URL: https://datasheet.ciiva.com/46440/1868787-46440891.pdf?src-supplier=Element14; ComponentLink4Description: https://datasheet.ciiva.com/46440/1868787-46440891.pdf?src-supplier=Element14; ComponentLink5URL: https://datasheet.ciiva.com/22747/443971-22747519.pdf?src-supplier=Element14; ComponentLink5Description: https://datasheet.ciiva.com/22747/443971-22747519.pdf?src-supplier=Element14; ComponentLink6URL: https://datasheet.ciiva.com/7983/443971-7983596.pdf?src-supplier=Element14; ComponentLink6Description: https://datasheet.ciiva.com/7983/443971-7983596.pdf?src-supplier=Element14; Case Package: 0603
RL1 RL2 = ALQ112: RELAY GEN PURPOSE SPDT 10A 12V; Manufacturer: Panasonic; Designed By: Görkem Bulut; Voltage Rating(AC): 250V; Coil Current: 33.3 mA; Supplier: Digi-Key; Supplier Part Number: 255-3562-ND; Manufacturer Part Number: ALQ112; RoHS: Yes; Category: Power Relays; Stock: 1548; Pricing: 1=1,31, 10=1,228, 25=1,092, 50=1,0372, 100=0,9826, 250=0,87344, 500=0,81884, 1000=0,76426, 5000=0,73696 (USD); ComponentLink1URL: https://datasheet.ciiva.com/24388/307ds-61b20-en-lq-24388909.pdf?src-supplier=Onlinecomponents.com; ComponentLink1Description: https://datasheet.ciiva.com/24388/307ds-61b20-en-lq-24388909.pdf?src-supplier=Onlinecomponents.com; Supplier 1: Mouser; Supplier Part Number 1: 769-ALQ112; Number of Pins: 5; Operating Temperature: -40°C ~ 85°C; Depth: 10mm; Height: 16mm; Width: 10mm; Length: 20mm; Series: ALQ; Case Package: ALQ112
T1 = BV302S12010: Sealed Transformer EI30/10.5; Manufacturer: Zettler Magnetics; Designed By: Görkem Bulut; Primary Voltage: 230V; Secondary Voltage: 12V; Operating Frequency: 50-60Hz; Supplier: Digi-Key; Supplier Part Number: 3388-BV302S12010-ND; Manufacturer Part Number: BV302S12010; RoHS: No; Category: Uncategorized; Pricing: 1=3,22, 10=2,611, 25=2,1108, 50=1,9776, 100=1,8887, 250=1,83316, 500=1,7776, 1000=1,72205, 5000=1,58318 (USD); RoHS Compliant: No
U1 = LM2675MX-12/NOPB: Buck Switching Regulator IC Positive Fixed 12V 1 Output 1A 8-SOIC (0.154", 3.90mm Width); Manufacturer: TI National Semiconductor; Designed by: Görkem Bulut; ComponentLink1URL: https://datasheet.ciiva.com/41457/001013881-da-01-en-ic-reg-buck-lm2675mx-12-nopb-soic-8-tid-41457896.pdf?src-supplier=Conrad; ComponentLink1Description: https://datasheet.ciiva.com/41457/001013881-da-01-en-ic-reg-buck-lm2675mx-12-nopb-soic-8-tid-41457896.pdf?src-supplier=Conrad; ComponentLink2URL: https://datasheet.ciiva.com/3220/lm2675-3220840.pdf?src-supplier=Avnet; ComponentLink2Description: https://datasheet.ciiva.com/3220/lm2675-3220840.pdf?src-supplier=Avnet; Supplier: Digi-Key; Supplier Part Number: 296-35410-6-ND; Manufacturer Part Number: LM2675MX-12/NOPB; RoHS: Yes; Category: Voltage Regulators - Switching; Pricing: 1=4,85, 10=4,356, 25=4,1184, 100=3,5693, 250=3,38624, 500=3,03846, 1000=2,56256 (USD); Case Package: 8-SOIC; Number of Pins: 8
U2 = AP7361C-33E-13: LDO Regulator Pos 3.3V 1A 4-Pin(3+Tab) SOT-223 T/R; Manufacturer: Diodes; Designed by: Görkem Bulut; Supplier: Digi-Key; Supplier Part Number: AP7361C-33E-13DICT-ND; Manufacturer Part Number: AP7361C-33E-13; RoHS: Yes; Category: TVS Diodes; Stock: 46517; Pricing: 1=0,6, 10=0,517, 25=0,4824, 100=0,386, 250=0,35844, 500=0,3033, 1000=0,23437 (USD); ComponentLink1URL: http://www.mouser.com/ds/2/115/AP7361C-775034.pdf?src-supplier=Mouser; ComponentLink1Description: http://www.mouser.com/ds/2/115/AP7361C-775034.pdf?src-supplier=Mouser; ComponentLink2URL: https://datasheet.octopart.com/AP7361C-33E-13-Diodes-Inc.-datasheet-101745716.pdf?src-supplier=Future+Electronics; ComponentLink2Description: https://datasheet.octopart.com/AP7361C-33E-13-Diodes-Inc.-datasheet-101745716.pdf?src-supplier=Future+Electronics; ComponentLink3URL: https://www.diodes.com/assets/Datasheets/AP7361C.pdf?src-supplier=Digi-Key; ComponentLink3Description: https://www.diodes.com/assets/Datasheets/AP7361C.pdf?src-supplier=Digi-Key; ComponentLink4URL: https://datasheet.octopart.com/AP7361C-33E-13-Diodes-Inc.-datasheet-101745716.pdf?src-supplier=Element14; ComponentLink4Description: https://datasheet.octopart.com/AP7361C-33E-13-Diodes-Inc.-datasheet-101745716.pdf?src-supplier=Element14; ComponentLink5URL: https://datasheet.octopart.com/AP7361C-33E-13-Diodes-Inc.-datasheet-158996477.pdf?src-supplier=SHENGYU+ELECTRONICS; ComponentLink5Description: https://datasheet.octopart.com/AP7361C-33E-13-Diodes-Inc.-datasheet-158996477.pdf?src-supplier=SHENGYU+ELECTRONICS; Case Package: SOT223; Number of Pins: 3
USB1 = Micro B USB Connector: CONN USB MICRO B RECPT SMT R/A; Manufacturer: Amphenol ICC / FCI; Manufacturer Part Number: 10118192-0001LF; Designed By: Görkem BULUT; Connector Type: USB,Receptacle; Number of Contacts: 5; Gender: Receptacle; Current Rating: 1.8A; Insulation Resistance: 1GR; Number of Ports: 1; Max Voltage Rating (AC): 100V; Pitch: 0.65mm; Supplier: Digi-Key; Supplier Part Number: 609-4613-1-ND; RoHS: No; Category: USB Connectors; Stock: 111752; Pricing: 1=0,46, 10=0,404, 25=0,3696, 50=0,3478, 100=0,3334, 250=0,30436, 500=0,28988 (USD); Mounting Technology: Surface Mount,Horizontal; Pins: 5; Color: Black; Contact Material: Copper Alloy; Contact Plating: Gold; Housing Material: Polymer; Min Operating Temperature: -55°C; Max Operating Temperature: 85°C; Features: Shielded; USB Standard: USB 2.0; Series: -; Packaging: Tape and Reel; Termination: Solder; Package Quantity: 1400; Orientation: Right Angle; Voltage Rating: 100V; Length: 7.86mm; Depth: 5.57mm; Radiation Hardening: No; Flammability Rating: UL94 V-0; Reach SVHC Compliant: No